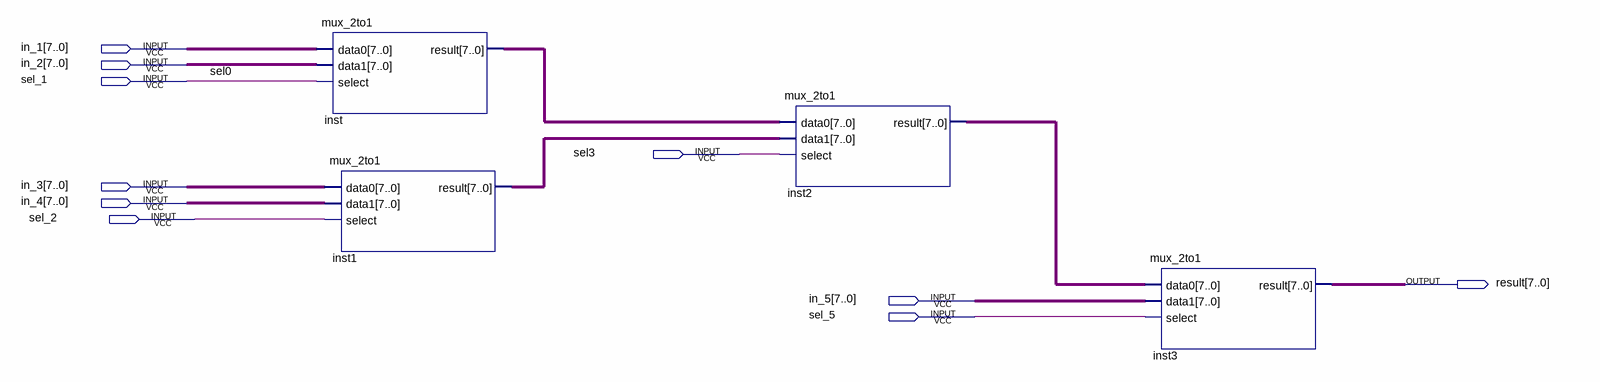
[diagram p0: schematic sheet]
// Quartus schematic mux5to1.bdf as structural Verilog: 4 symbols, 10 pins
module mux5to1 (
  input  [7:0] in_1,
  input  [7:0] in_2,
  input  sel_1,
  input  sel3,
  input  [7:0] in_3,
  input  [7:0] in_4,
  input  sel_2,
  input  [7:0] in_5,
  input  sel_5,
  output [7:0] result
);

  wire [7:0] inst1_result, inst2_result, inst_result;

  mux_2to1 inst (.data0(in_1), .data1(in_2), .select(sel_1), .result(inst_result));
  mux_2to1 inst1 (.data0(in_3), .data1(in_4), .select(sel_2), .result(inst1_result));
  mux_2to1 inst2 (.data0(inst_result), .data1(inst1_result), .select(sel3), .result(inst2_result));
  mux_2to1 inst3 (.data0(inst2_result), .data1(in_5), .select(sel_5), .result(result));

  // Other names for the same wires on the sheet: sel0 = sel_1
endmodule
